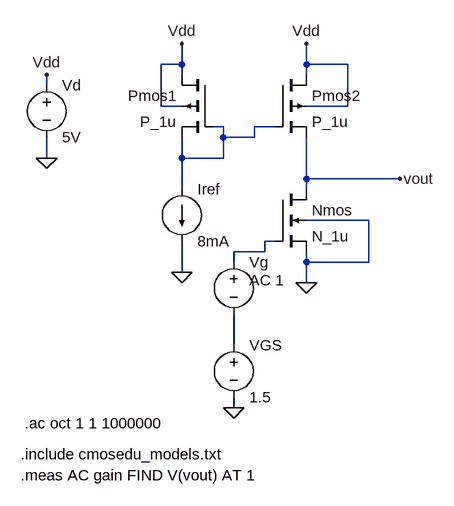
[diagram p0: schematic ex5.asc]
ex5.asc, the LTspice schematic file:
Version 4
SHEET 1 880 680
WIRE -1968 -1008 -1968 -1040
WIRE -1968 -1008 -2000 -1008
WIRE -1776 -1008 -1776 -1040
WIRE -1712 -1008 -1776 -1008
WIRE -1968 -992 -1968 -1008
WIRE -1776 -992 -1776 -1008
WIRE -2176 -976 -2176 -992
WIRE -2000 -944 -2000 -1008
WIRE -1968 -944 -2000 -944
WIRE -1712 -944 -1712 -1008
WIRE -1712 -944 -1776 -944
WIRE -1904 -912 -1920 -912
WIRE -1824 -912 -1856 -912
WIRE -1904 -896 -1904 -912
WIRE -1856 -896 -1856 -912
WIRE -1856 -896 -1904 -896
WIRE -2176 -864 -2176 -896
WIRE -1968 -864 -1968 -896
WIRE -1904 -864 -1904 -896
WIRE -1904 -864 -1968 -864
WIRE -1776 -832 -1776 -896
WIRE -1632 -832 -1776 -832
WIRE -1968 -816 -1968 -864
WIRE -1776 -816 -1776 -832
WIRE -1680 -768 -1776 -768
WIRE -1824 -736 -1840 -736
WIRE -1840 -720 -1840 -736
WIRE -1840 -720 -1888 -720
WIRE -1888 -704 -1888 -720
WIRE -1776 -704 -1776 -720
WIRE -1680 -704 -1680 -768
WIRE -1680 -704 -1776 -704
WIRE -1968 -688 -1968 -736
WIRE -1776 -672 -1776 -704
WIRE -1888 -576 -1888 -624
WIRE -1888 -480 -1888 -496
FLAG -2176 -864 0
FLAG -2176 -992 Vdd
FLAG -1968 -1040 Vdd
FLAG -1776 -1040 Vdd
FLAG -1968 -688 0
FLAG -1776 -672 0
FLAG -1632 -832 vout
FLAG -1888 -480 0
SYMBOL voltage -2176 -992 R0
SYMATTR InstName Vd
SYMATTR Value 5V
SYMBOL pmos4 -1920 -992 M0
SYMATTR InstName Pmos1
SYMATTR Value P_1u
SYMATTR Value2 l=7.5u w=80u
SYMBOL pmos4 -1824 -992 R0
SYMATTR InstName Pmos2
SYMATTR Value P_1u
SYMATTR Value2 l=1.5u w=80u
SYMBOL current -1968 -816 R0
WINDOW 123 0 0 Left 2
WINDOW 39 0 0 Left 2
SYMATTR InstName Iref
SYMATTR Value 8mA
SYMBOL nmos4 -1824 -816 R0
SYMATTR InstName Nmos
SYMATTR Value N_1u
SYMATTR Value2 l=1.5u w=80u
SYMBOL voltage -1888 -592 R0
WINDOW 123 0 0 Left 2
WINDOW 39 0 0 Left 2
SYMATTR InstName VGS
SYMATTR Value 1.5
SYMBOL voltage -1888 -720 R0
WINDOW 123 24 44 Left 2
WINDOW 39 0 0 Left 2
SYMATTR InstName Vg
SYMATTR Value ""
SYMATTR Value2 AC 1
TEXT -2210 -456 Left 2 !.ac oct 1 1 1000000
TEXT -2216 -408 Left 2 !.include cmosedu_models.txt
TEXT -2216 -376 Left 2 !.meas AC gain FIND V(vout) AT 1

The netlist it stands for:
* ex5.asc
Vd Vdd 0 5V
M§Pmos1 Vdd N001 N001 Vdd P_1u l=7.5u w=80u
M§Pmos2 Vdd N001 vout Vdd P_1u l=1.5u w=80u
Iref N001 0 8mA
M§Nmos vout N002 0 0 N_1u l=1.5u w=80u
VGS N003 0 1.5
Vg N002 N003 AC 1
.model NMOS NMOS
.model PMOS PMOS
.lib standard.mos
.ac oct 1 1 1000000
.include cmosedu_models.txt
.meas AC gain FIND V(vout) AT 1
.backanno
.end